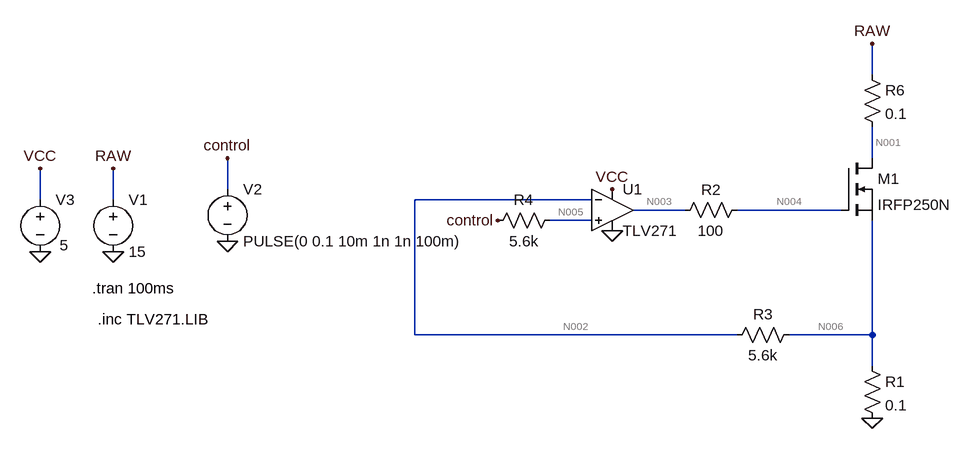
[diagram p0: schematic mosfet.asc]
mosfet.asc, the LTspice schematic file:
Version 4
SHEET 1 1028 728
WIRE 688 -192 688 -240
WIRE 688 -64 688 -112
WIRE -304 -16 -304 -64
WIRE -592 0 -592 -48
WIRE -480 0 -480 -48
WIRE 256 0 -16 0
WIRE 400 16 320 16
WIRE 640 16 480 16
WIRE 256 32 192 32
WIRE -16 208 -16 0
WIRE 480 208 -16 208
WIRE 688 208 688 32
WIRE 688 208 560 208
WIRE 688 256 688 208
FLAG 688 336 0
FLAG -480 80 0
FLAG -480 -48 RAW
FLAG 688 -240 RAW
FLAG -304 64 0
FLAG -304 -64 control
FLAG 288 48 0
FLAG -592 80 0
FLAG -592 -48 VCC
FLAG 288 -16 VCC
FLAG 112 32 control
SYMBOL nmos 640 -64 R0
SYMATTR InstName M1
SYMATTR Value IRFP250N
SYMBOL voltage -480 -16 R0
WINDOW 123 0 0 Left 0
WINDOW 39 0 0 Left 0
SYMATTR InstName V1
SYMATTR Value 15
SYMBOL voltage -304 -32 R0
WINDOW 123 0 0 Left 0
WINDOW 39 0 0 Left 0
SYMATTR InstName V2
SYMATTR Value PULSE(0 0.1 10m 1n 1n 100m)
SYMBOL res 672 240 R0
SYMATTR InstName R1
SYMATTR Value 0.1
SYMBOL res 496 0 R90
WINDOW 0 0 56 VBottom 2
WINDOW 3 32 56 VTop 2
SYMATTR InstName R2
SYMATTR Value 100
SYMBOL res 672 -208 R0
SYMATTR InstName R6
SYMATTR Value 0.1
SYMBOL OpAmps\\opamp2 288 -48 R0
SYMATTR InstName U1
SYMATTR Value TLV271
SYMBOL res 576 192 R90
WINDOW 0 0 56 VBottom 2
WINDOW 3 32 56 VTop 2
SYMATTR InstName R3
SYMATTR Value 5.6k
SYMBOL voltage -592 -16 R0
WINDOW 123 24 44 Left 2
WINDOW 39 0 0 Left 0
WINDOW 3 30 86 Left 2
SYMATTR InstName V3
SYMATTR Value 5
SYMBOL res 208 16 R90
WINDOW 0 0 56 VBottom 2
WINDOW 3 32 56 VTop 2
SYMATTR InstName R4
SYMATTR Value 5.6k
TEXT -512 136 Left 2 !.tran 100ms
TEXT -504 184 Left 2 !.inc TLV271.LIB

The netlist it stands for:
* mosfet.asc
M1 N001 N004 N006 N006 IRFP250N
V1 RAW 0 15
V2 control 0 PULSE(0 0.1 10m 1n 1n 100m)
R1 N006 0 0.1
R2 N004 N003 100
R6 RAW N001 0.1
XU1 N005 N002 VCC 0 N003 TLV271  ; pins In+ In- V+ V- OUT
R3 N006 N002 5.6k
V3 VCC 0 5
R4 N005 control 5.6k
.model NMOS NMOS
.model PMOS PMOS
.lib standard.mos
.tran 100ms
.inc TLV271.LIB
.backanno
.end

* Results of the author's LTspice run, read from the files saved beside the schematic
* Operating Point, zero values left out:
*   V(n001) = 15 V
*   V(n004) = 3.878 V
*   V(n006) = 432.7 µV
*   V(raw) = 15 V
*   V(n003) = 3.878 V
*   V(vcc) = 5 V
*   V(n002) = 432.7 µV
*   V(n005) = 38.65 nV
*   Id(M1) = 4.327 mA
*   Is(M1) = -4.327 mA
*   I(R1) = 4.327 mA
*   I(R6) = 4.327 mA
*   I(R3) = -6.9 pA
*   I(R4) = 6.902 pA
*   I(V1) = -4.327 mA
*   I(V2) = 6.902 pA
*   I(V3) = -34.55 µA
*   Ix(u1:1) = -6.902 pA
*   Ix(u1:2) = -6.9 pA
*   Ix(u1:3) = 34.55 µA
*   Ix(u1:4) = -34.56 µA
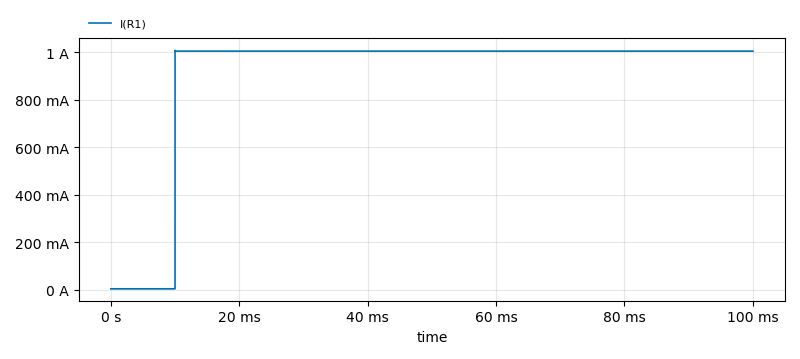
[diagram p1: Transient Analysis of mosfet.asc, plotted from the saved traces]
* Transient Analysis, 1 run:
*   I(R1): min 4.327 mA, max 1.007 A, average 903.9 mA, rms 952.3 mA, last 1.004 A